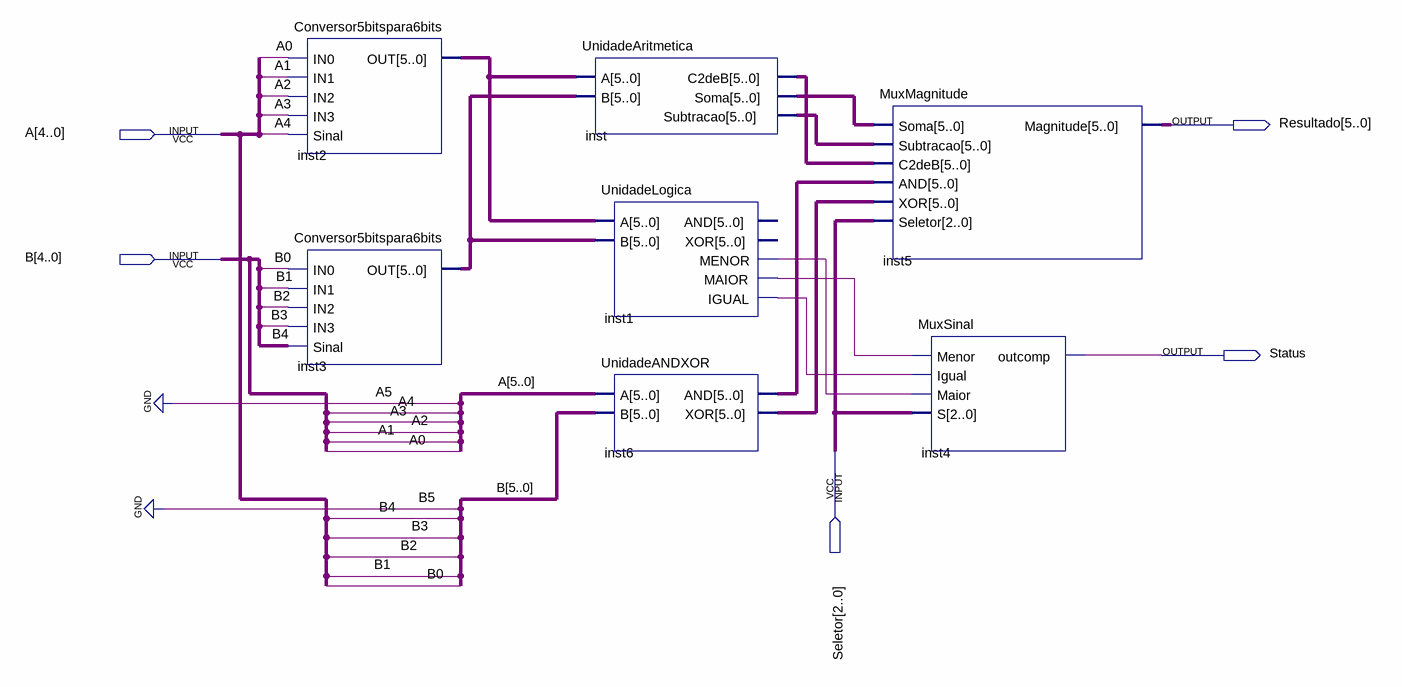
[diagram p0: schematic sheet]
// Quartus schematic ALU.bdf as structural Verilog: 7 symbols, 5 pins
module ALU (
  input  [4:0] A,
  input  [4:0] B,
  input  [2:0] Seletor,
  output [5:0] Resultado,
  output Status
);

  wire inst1_igual, inst1_maior, inst1_menor;
  wire [5:0] inst2_out, inst3_out, inst6_and, inst6_xor, inst_c2deb, inst_soma, inst_subtracao;

  Conversor5bitspara6bits inst2 (.IN0(A[0]), .IN1(A[1]), .IN2(A[2]), .IN3(A[3]), .Sinal(A[4]), .OUT(inst2_out));
  Conversor5bitspara6bits inst3 (.IN0(B[0]), .IN1(B[1]), .IN2(B[2]), .IN3(B[3]), .Sinal(B[4]), .OUT(inst3_out));
  UnidadeAritmetica inst (
    .A(inst2_out), .B(inst3_out), .C2deB(inst_c2deb), .Soma(inst_soma), .Subtracao(inst_subtracao));
  UnidadeLogica inst1 (
    .A(inst2_out), .B(inst3_out), .MENOR(inst1_menor), .MAIOR(inst1_maior), .IGUAL(inst1_igual));  // open: AND, XOR
  UnidadeANDXOR inst6 (.A({1'b0, A}), .B({1'b0, B}), .AND(inst6_and), .XOR(inst6_xor));
  MuxMagnitude inst5 (
    .Soma(inst_soma), .Subtracao(inst_subtracao), .C2deB(inst_c2deb), .AND(inst6_and), .XOR(inst6_xor),
    .Seletor(Seletor), .Magnitude(Resultado));
  MuxSinal inst4 (.Menor(inst1_maior), .Igual(inst1_igual), .Maior(inst1_menor), .S(Seletor), .outcomp(Status));
endmodule
